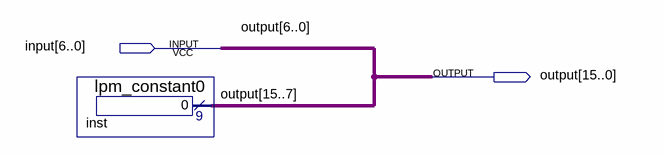
[diagram p0: schematic sheet]
// Quartus schematic extend7to16.bdf as structural Verilog: 1 symbols, 2 pins
module extend7to16 (
  input  [6:0] \input ,
  output [15:0] \output 
);

  lpm_constant0 inst (.result(\output [15:7]));

  assign \output [6:0] = \input ;
endmodule
